# Altium schematic sheet medianFilter.SchDoc
size A3
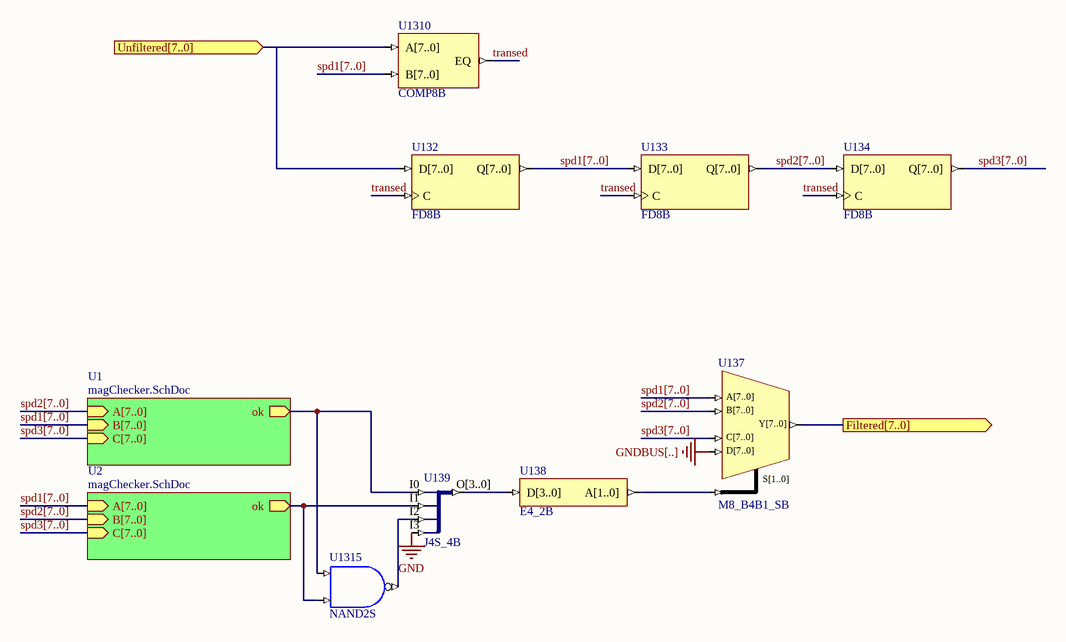
[diagram p0: medianFilter.SchDoc]

## Parts
U132  FD8B
U133  FD8B
U134  FD8B
U137  M8_B4B1_SB
U138  E4_2B
U139  J4S_4B
U1310  COMP8B
U1315  NAND2S

## Sub-sheets
U1 = magChecker.SchDoc: A[7..0] (in), B[7..0] (in), C[7..0] (in), ok (out)
U2 = magChecker.SchDoc: A[7..0] (in), B[7..0] (in), C[7..0] (in), ok (out)

## Ports
Filtered[7..0] (out), Unfiltered[7..0] (in)

## Nets
GND: U139.I3
GNDBUS[..]: U137.D[7..0]
Filtered[7..0]: U137.Y[7..0] ; port Filtered[7..0]
spd1[7..0]: U132.Q[7..0] U133.D[7..0] U137.A[7..0] U1310.B[7..0] ; sheet U1/B[7..0], sheet U2/A[7..0]
spd2[7..0]: U133.Q[7..0] U134.D[7..0] U137.B[7..0] ; sheet U1/A[7..0], sheet U2/B[7..0]
spd3[7..0]: U134.Q[7..0] U137.C[7..0] ; sheet U1/C[7..0], sheet U2/C[7..0]
transed: U132.C U133.C U134.C U1310.EQ
Unfiltered[7..0]: U132.D[7..0] U1310.A[7..0] ; port Unfiltered[7..0]
NetU137_S[1..0]: U137.S[1..0] U138.A[1..0]
NetU138_D[3..0]: U138.D[3..0] U139.O[3..0]
NetU139_I0: U139.I0 U1315.I0 ; sheet U1/ok
NetU139_I1: U139.I1 U1315.I1 ; sheet U2/ok
NetU139_I2: U139.I2 U1315.O

## Buses and harness runs
bus spd1[7..0]
bus spd1[7..0] = sheet U1/B[7..0]
bus spd1[7..0] = sheet U2/A[7..0]
bus spd2[7..0]
bus spd2[7..0] = sheet U1/A[7..0]
bus spd2[7..0] = sheet U2/B[7..0]
bus spd3[7..0]
bus spd3[7..0] = sheet U1/C[7..0]
bus spd3[7..0] = sheet U2/C[7..0]

## Library data of the parts
U132-U134 = FD8B: 8-Bit D-Type Flip-Flop, Bus Version; XilinxEquivalent: FD8; SubClass: FD; ClockTrigger: Rising; PortSize: 8; ArchiveName: GENERIC; VHDLIB_SIM: GENERIC_LIB; Published: 29-Jan-2004; Publisher: Altium Limited; LastRevisionNo: 1.00.00; HelpURL: CR0118 FPGA Generic Library Guide.pdf#page=170; ComponentLink1URL: CR0133 FPGA Flip Flop Resource Usage.pdf#page=69; ComponentLink1Description: Core &Resource Usage; FunctionalClass: Flip-Flop; PortStyle: Bus Version
U137 = M8_B4B1_SB: 4x8-Bit Bus to 1x8-Bit Bus Multiplexer With Bus Version Select; SubClass: BnB1; BusBusSelect: True; PortSize: 8; ArchiveName: GENERIC; VHDLIB_SIM: GENERIC_LIB; Published: 31-May-2004; Publisher: Altium Limited; LastRevisionNo: 1.00.00; HelpURL: CR0118 FPGA Generic Library Guide.pdf#page=370; ComponentLink1URL: CR0137 FPGA Multiplexer Resource Usage.pdf#page=305; ComponentLink1Description: Core &Resource Usage; FunctionalClass: Multiplexer; PortStyle: Bus Version
U138 = E4_2B: 4- to 2-Bit Priority Encoder, Bus Version; SubClass: n_m; PortSize: 2; ArchiveName: GENERIC; VHDLIB_SIM: GENERIC_LIB; Published: 29-Jan-2004; Publisher: Altium Limited; LastRevisionNo: 1.00.00; HelpURL: CR0118 FPGA Generic Library Guide.pdf#page=164; ComponentLink1URL: CR0132 FPGA Encoder Resource Usage.pdf#page=2; ComponentLink1Description: Core &Resource Usage; FunctionalClass: Encoder; PortStyle: Bus Version
U139 = J4S_4B: 4 Single pin inputs to single 4-Bit output bus; FunctionalClass: Bus Joiner; PortSize: 4; ArchiveName: GENERIC; VHDLIB_SIM: GENERIC_LIB; Published: 29-Jan-2004; Publisher: Altium Limited; LastRevisionNo: 1.00.00; HelpURL: CR0118 FPGA Generic Library Guide.pdf#page=306; ComponentLink1URL: CR0126 FPGA Bus Joiner Resource Usage.pdf#page=12; ComponentLink1Description: Core &Resource Usage
U1310 = COMP8B: 8-Bit Identity Comparator, Bus Version; XilinxEquivalent: COMP8; SubClass: COMP; PortSize: 8; ArchiveName: GENERIC; VHDLIB_SIM: GENERIC_LIB; Published: 29-Jan-2004; Publisher: Altium Limited; LastRevisionNo: 1.00.00; HelpURL: CR0118 FPGA Generic Library Guide.pdf#page=151; ComponentLink1URL: CR0129 FPGA Comparator Resource Usage.pdf#page=14; ComponentLink1Description: Core &Resource Usage; FunctionalClass: Comparator; PortStyle: Bus Version
U1315 = NAND2: 2-Input NAND Gate, Single Pin Version; XilinxEquivalent: NAND2; FunctionalClass: Logic Primitive; PortSize: 2; ArchiveName: GENERIC; VHDLIB_SIM: GENERIC_LIB; Published: 29-Jan-2004; Publisher: Altium Limited; LastRevisionNo: 1.00.00; HelpURL: CR0118 FPGA Generic Library Guide.pdf#page=402; ComponentLink1URL: CR0136 FPGA Logic Primitive Resource Usage.pdf#page=90; ComponentLink1Description: Core &Resource Usage; SubClass: NAND; PortStyle: Single Pin Version